# EasyEDA schematic SCH_Altimeter1_2026-02-15.json
TITLE: Sheet_2; REV: 1.0; Date: 2026-02-13; Sheet: 1/1; Drawn By: jdhenckel; Company: Your Company
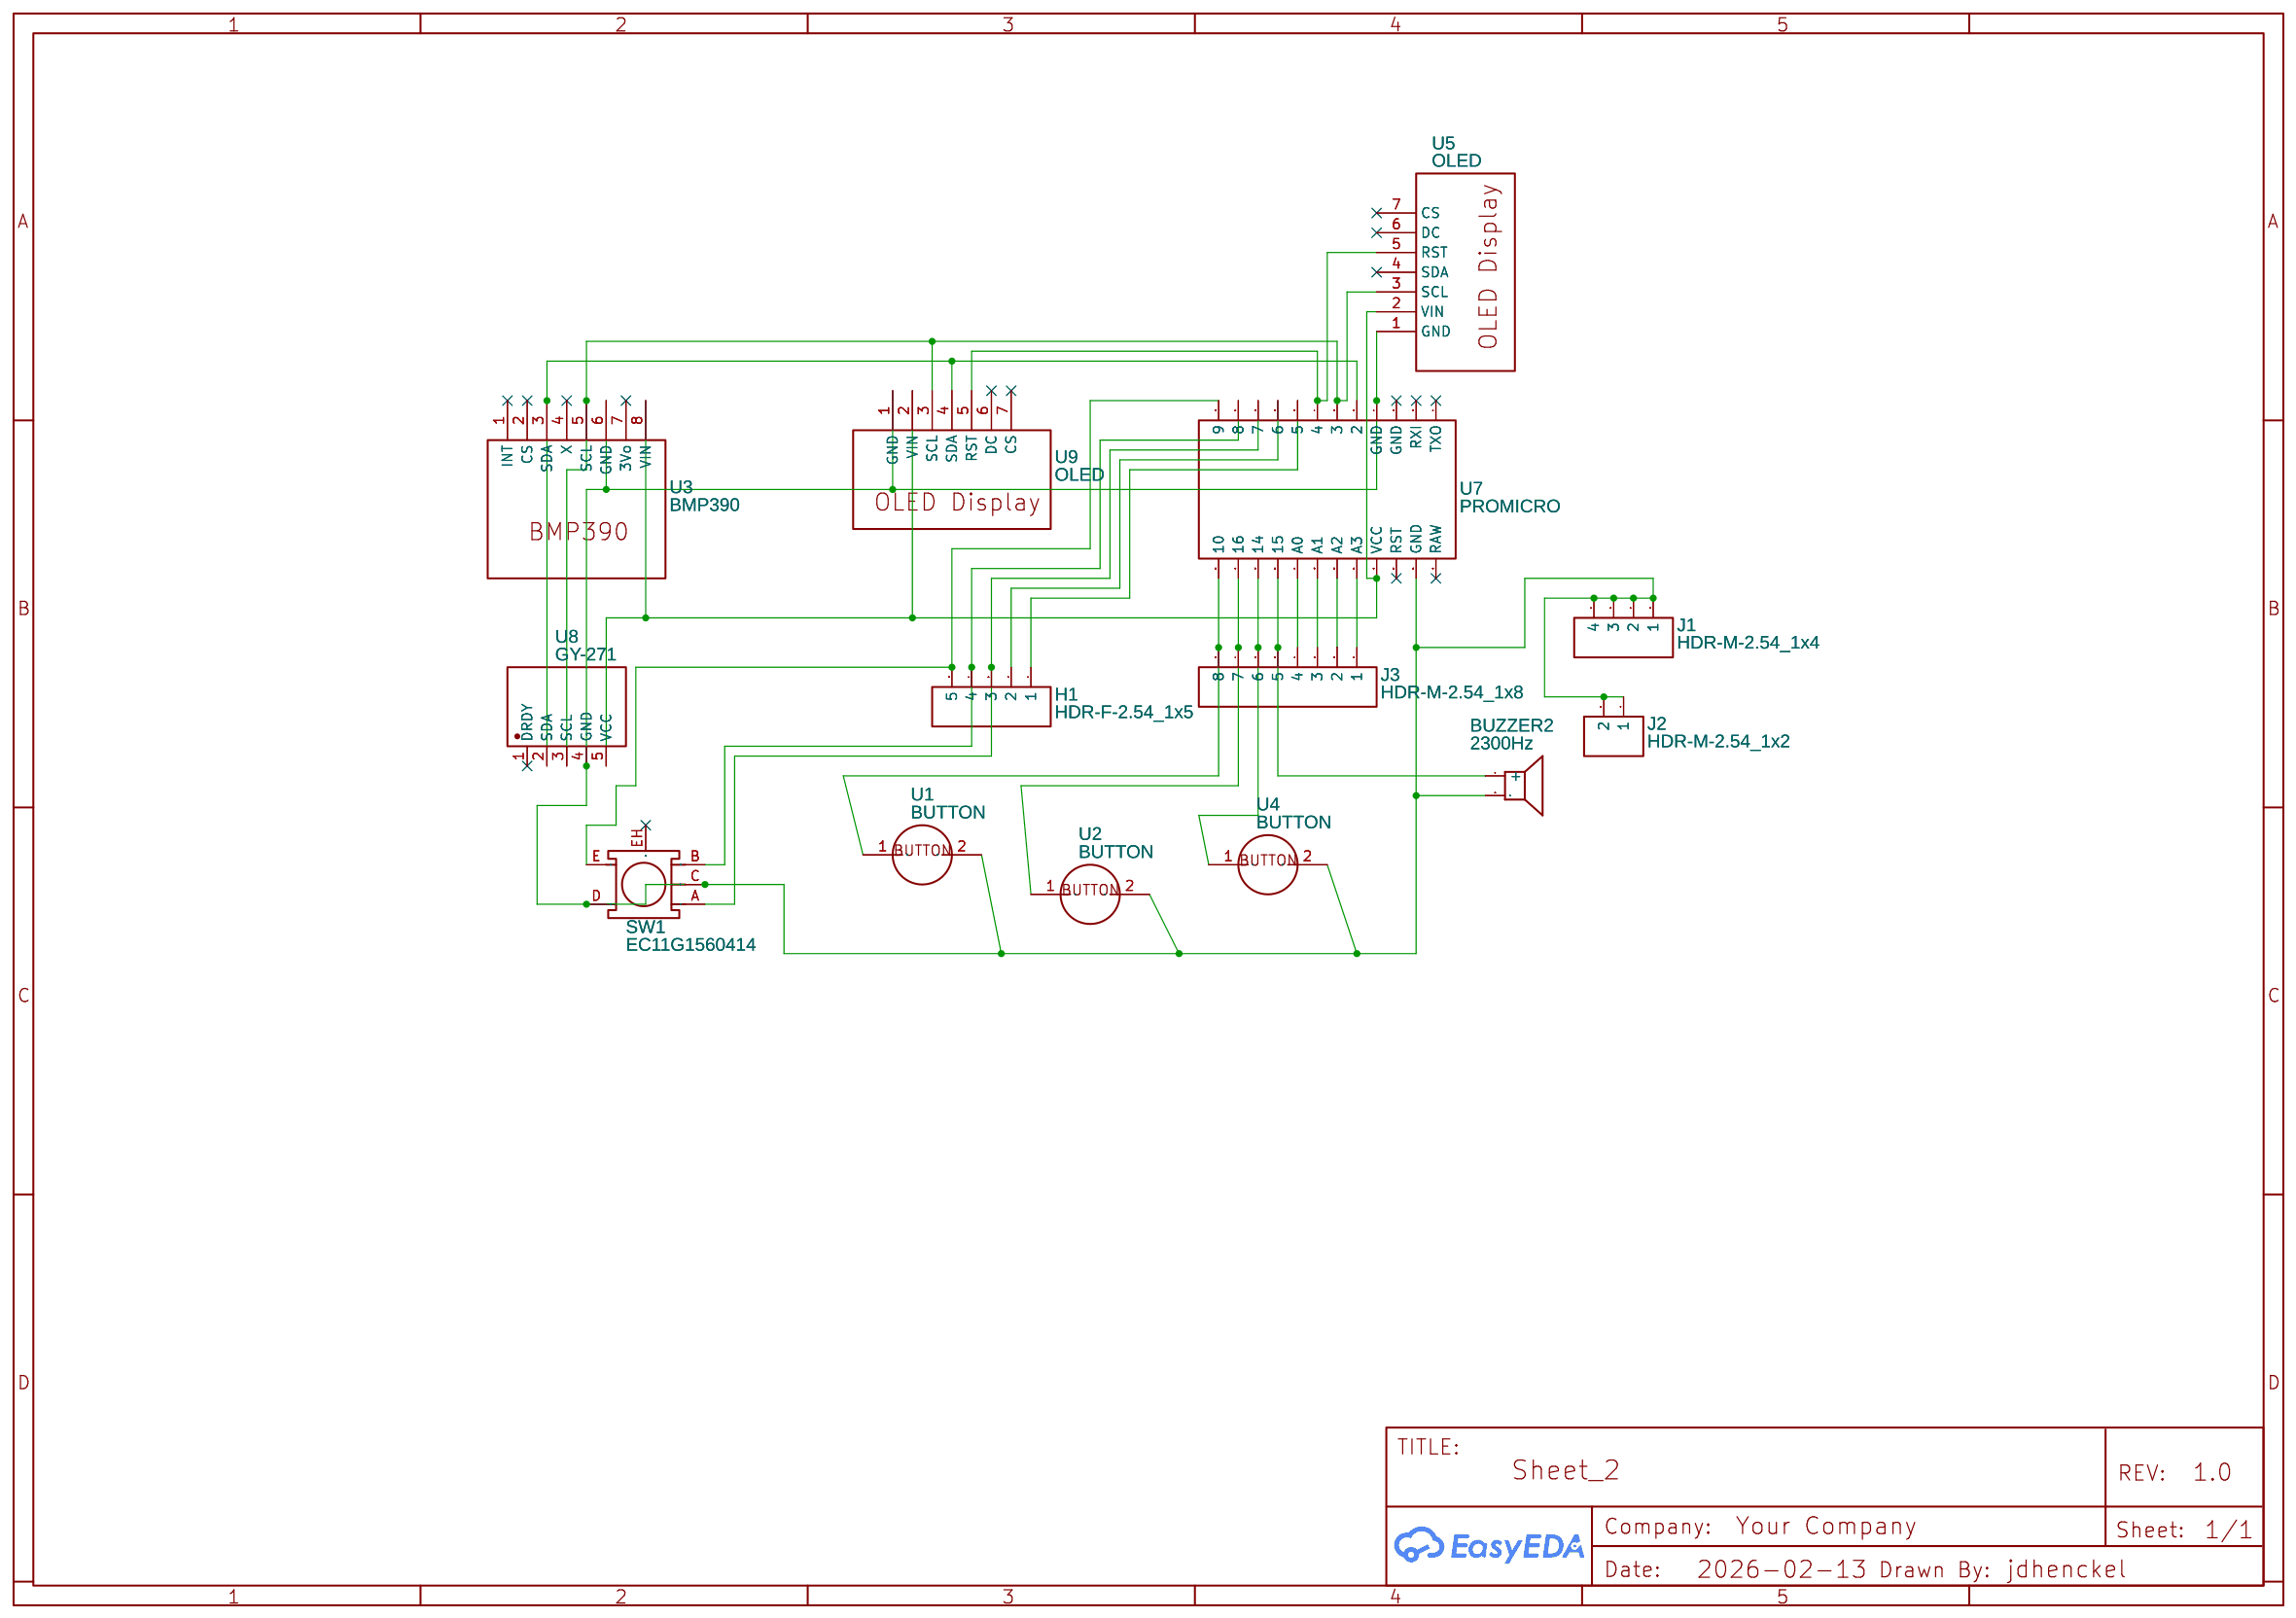
[diagram p0: schematic sheet]

## Parts
BUZZER2  2300Hz  [BUZ-TH_BD12.0-P7.60-D0.6-FD]
H1  HDR-F-2.54_1x5  [HDR-F-2.54_1X5]
J1  HDR-M-2.54_1x4  [HDR-M-2.54_1X4]
J2  HDR-M-2.54_1x2  [HDR-M-2.54_1X2]
J3  HDR-M-2.54_1x8  [HDR-M-2.54_1X8]
SW1  EC11G1560414  [SW-TH_EC11M1565403]
U1  BUTTON  [BUTTON]
U2  BUTTON  [BUTTON]
U3  BMP390  [BMP390]
U4  BUTTON  [BUTTON]
U5  OLED  [OLED_REV]
U7  PROMICRO  [PROMICRO]
U8  GY-271  [GY-271]
U9  OLED  [OLED_REV]

## Library data of the parts
BUZZER2 = TMB12A03: Supplier: LCSC; Manufacturer: 华能; Supplier Part: C96222; JLCPCB Part Class: Extended Part
H1 = HDR-F-2.54_1x5: Supplier Part: C50950; Supplier: LCSC; Contributor: LCEDA_Lib
J1 = HDR-M-2.54_1x4: Supplier Part: C124378; Supplier: LCSC; Contributor: LCEDA_Lib
J2 = HDR-M-2.54_1x2: Supplier Part: C124375; Supplier: LCSC; Contributor: LCEDA_Lib
J3 = HDR-M-2.54_1x8: Supplier Part: C190820; Supplier: LCSC; Contributor: LCEDA_Lib
SW1 = EC11G1560414: Contributor: LCSC; Supplier: LCSC; Supplier Part: C470719; Manufacturer: ALPSALPINE(阿尔卑斯阿尔派); JLCPCB Part Class: Extended Part
U1 U2 U4 = BUTTON: Contributor: jdhenckel
U3 = BMP390: Contributor: jdhenckel
U5 U9 = OLED: Contributor: jdhenckel
U7 = PROMICRO: Contributor: Dimster
U8 = GY-271: Contributor: MySelf9911

## Nets
Net-(BUZZER2-1): BUZZER2.1(+) J3.5 U7.16(15)
Net-(BUZZER2-2): BUZZER2.2 J1.1 J1.2 J1.3 J1.4 J2.1 J2.2 SW1.C SW1.D U1.2 U2.2 U3.6(GND) U4.2 U5.1(GND) U7.4(GND) U7.23(GND) U8.4(GND) U9.1(GND)
Net-(H1-1): H1.1 U7.8(5)
Net-(H1-2): H1.2 U7.9(6)
Net-(H1-3): H1.3 SW1.A U7.10(7)
Net-(H1-4): H1.4 SW1.B U7.11(8)
Net-(H1-5): H1.5 SW1.E U7.12(9)
Net-(J3-1): J3.1 U7.20(A3)
Net-(J3-2): J3.2 U7.19(A2)
Net-(J3-3): J3.3 U7.18(A1)
Net-(J3-4): J3.4 U7.17(A0)
Net-(J3-6): J3.6 U4.1 U7.15(14)
Net-(J3-7): J3.7 U2.1 U7.14(16)
Net-(J3-8): J3.8 U1.1 U7.13(10)
Net-(U3-3): U3.3(SDA) U7.5(2) U8.2(SDA) U9.4(SDA)
Net-(U3-5): U3.5(SCL) U5.3(SCL) U7.6(3) U8.3(SCL) U9.3(SCL)
Net-(U3-8): U3.8(VIN) U5.2(VIN) U7.21(VCC) U8.5(VCC) U9.2(VIN)
Net-(U5-5): U5.5(RST) U7.7(4) U9.5(RST)

Not connected (* = marked no-connect by the designer): SW1 EH*; U3 1(INT)* 2(CS)* 4(X)* 7(3Vo)*; U5 4(SDA)* 6(DC)* 7(CS)*; U7 1(TXO)* 2(RXI)* 3(GND)* 22(RST)* 24(RAW)*; U8 1(DRDY)*; U9 6(DC)* 7(CS)*
